# EasyEDA schematic 1-3circuits.json

## Sheets
1 mcu: TITLE: MCU and power filtering; REV: 1.0; Date: 2022-01-01; Sheet: 1/4; Drawn By: Mikita Valatovich; Company: MUNI MASTER DIPLOMA
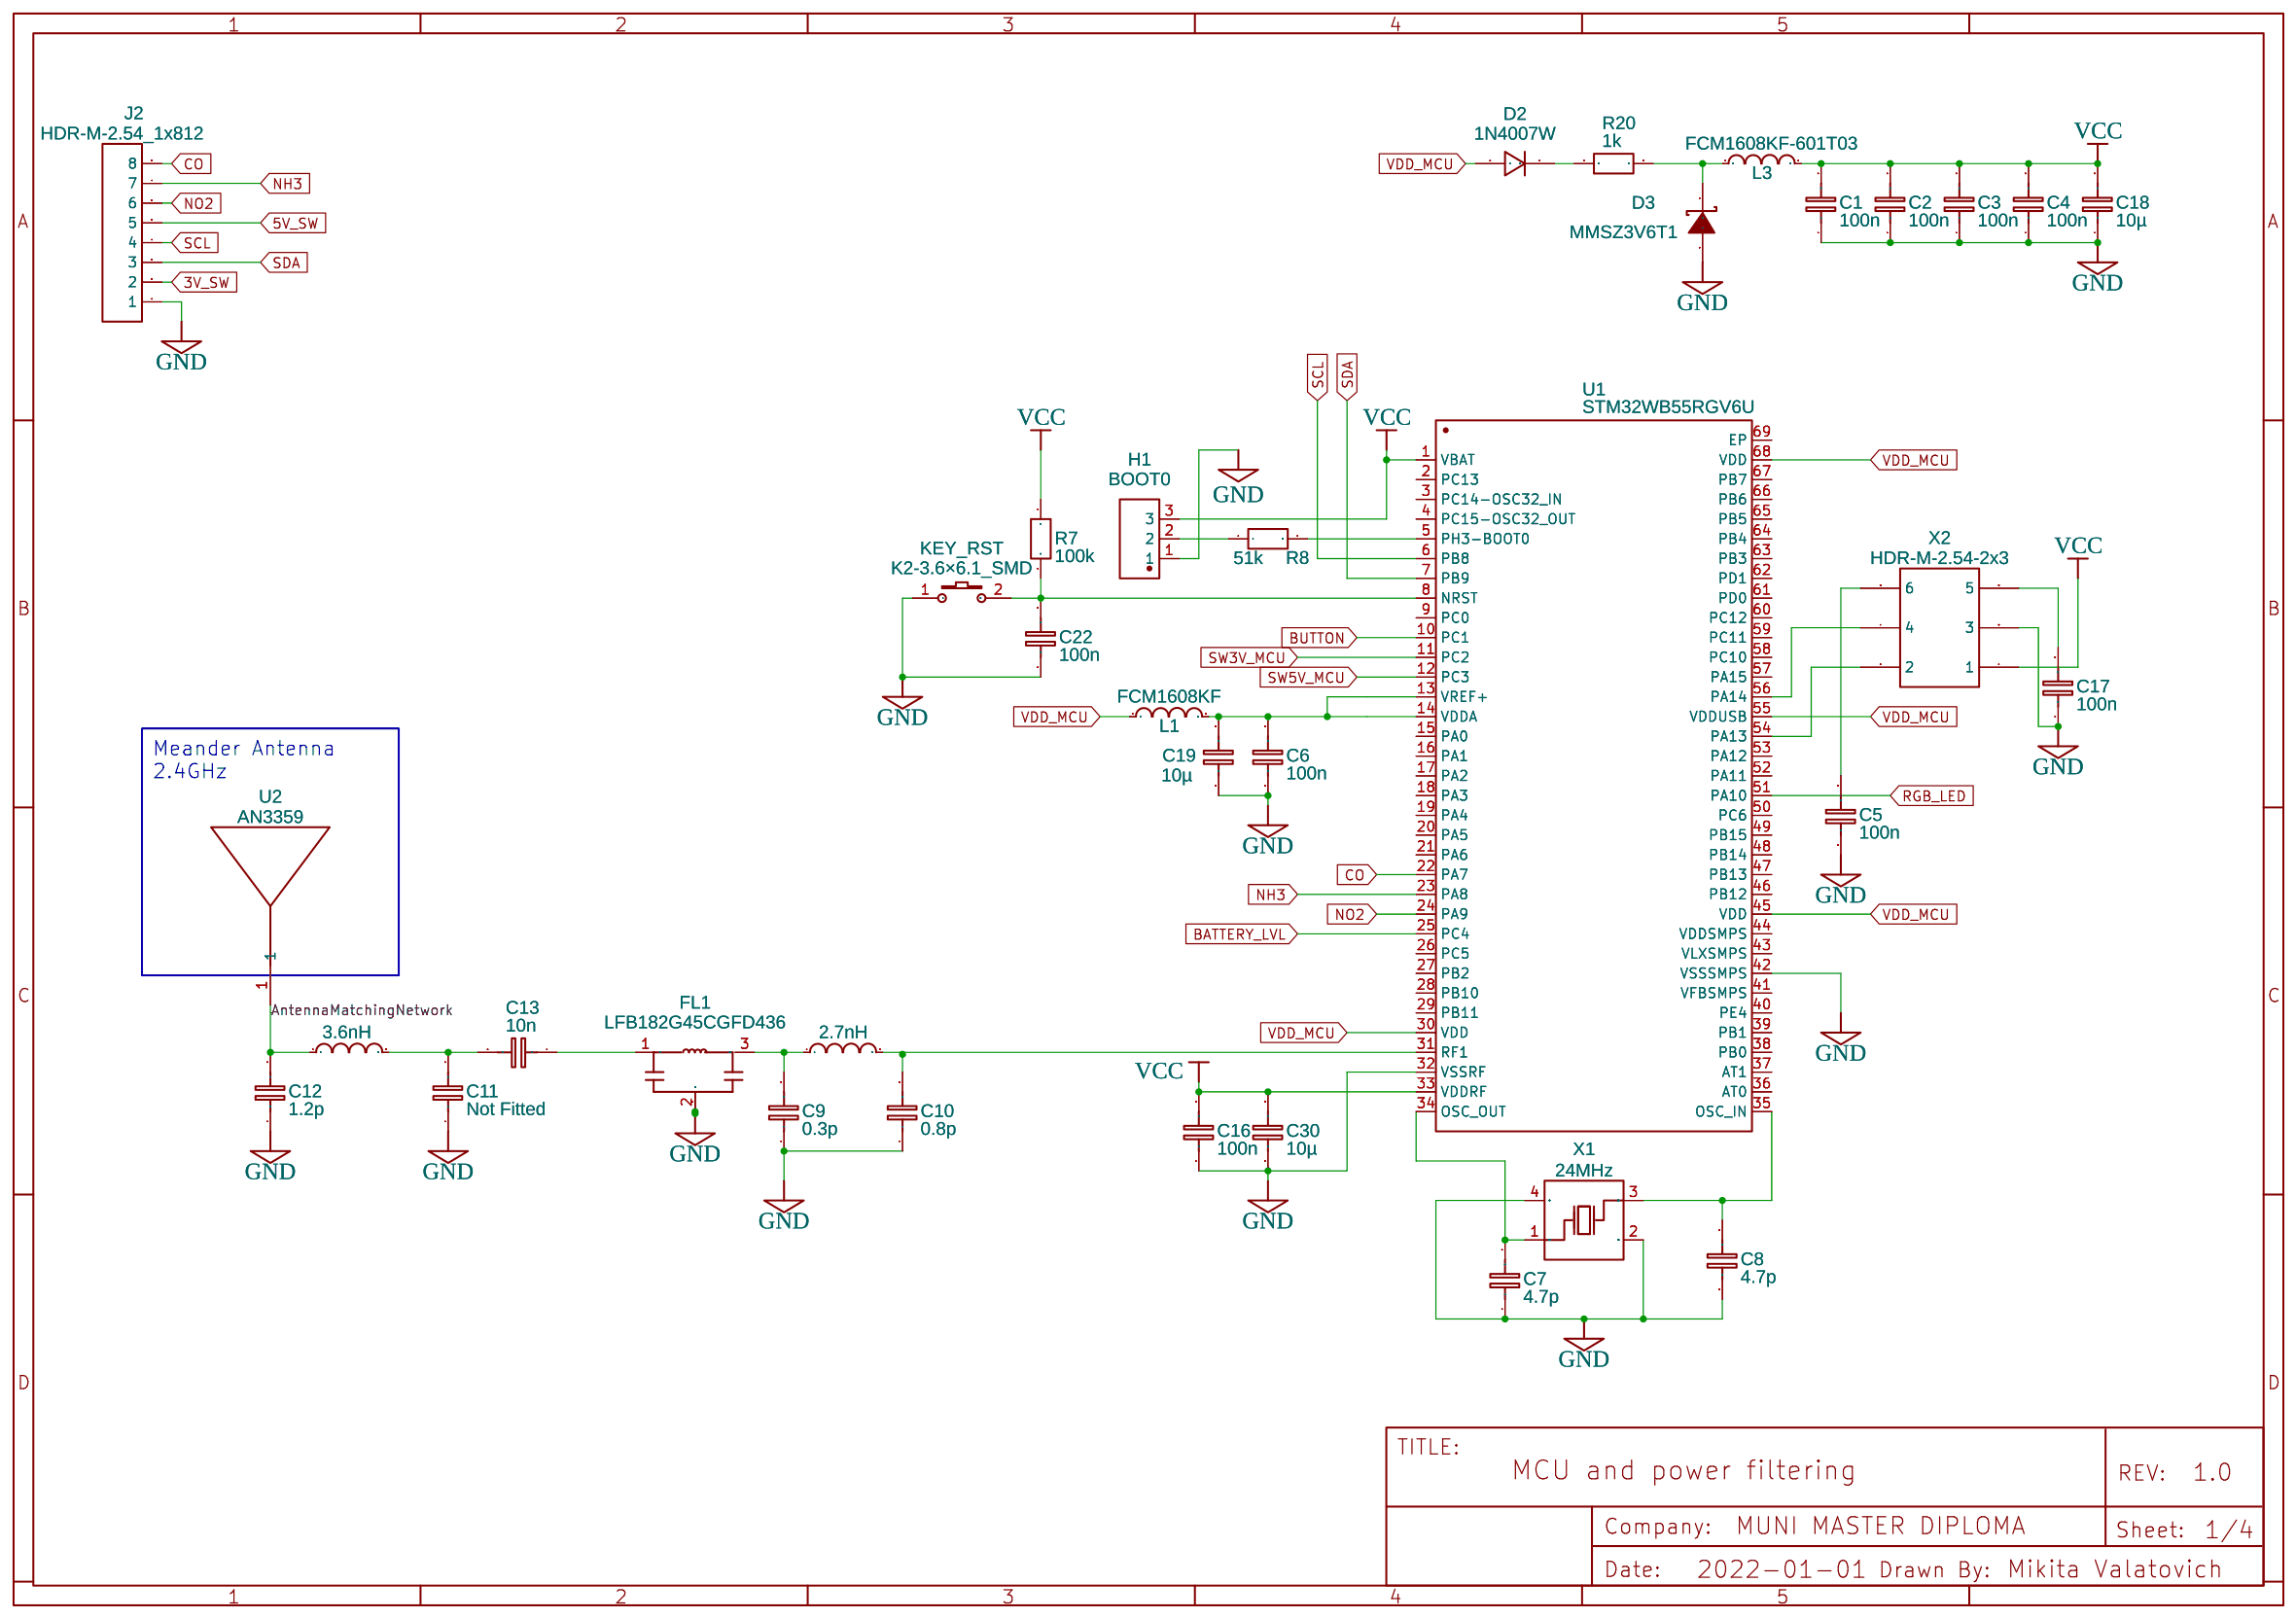
[diagram p0: mcu]
2 peripherals: TITLE: Peripherals; Sheet: 2/4
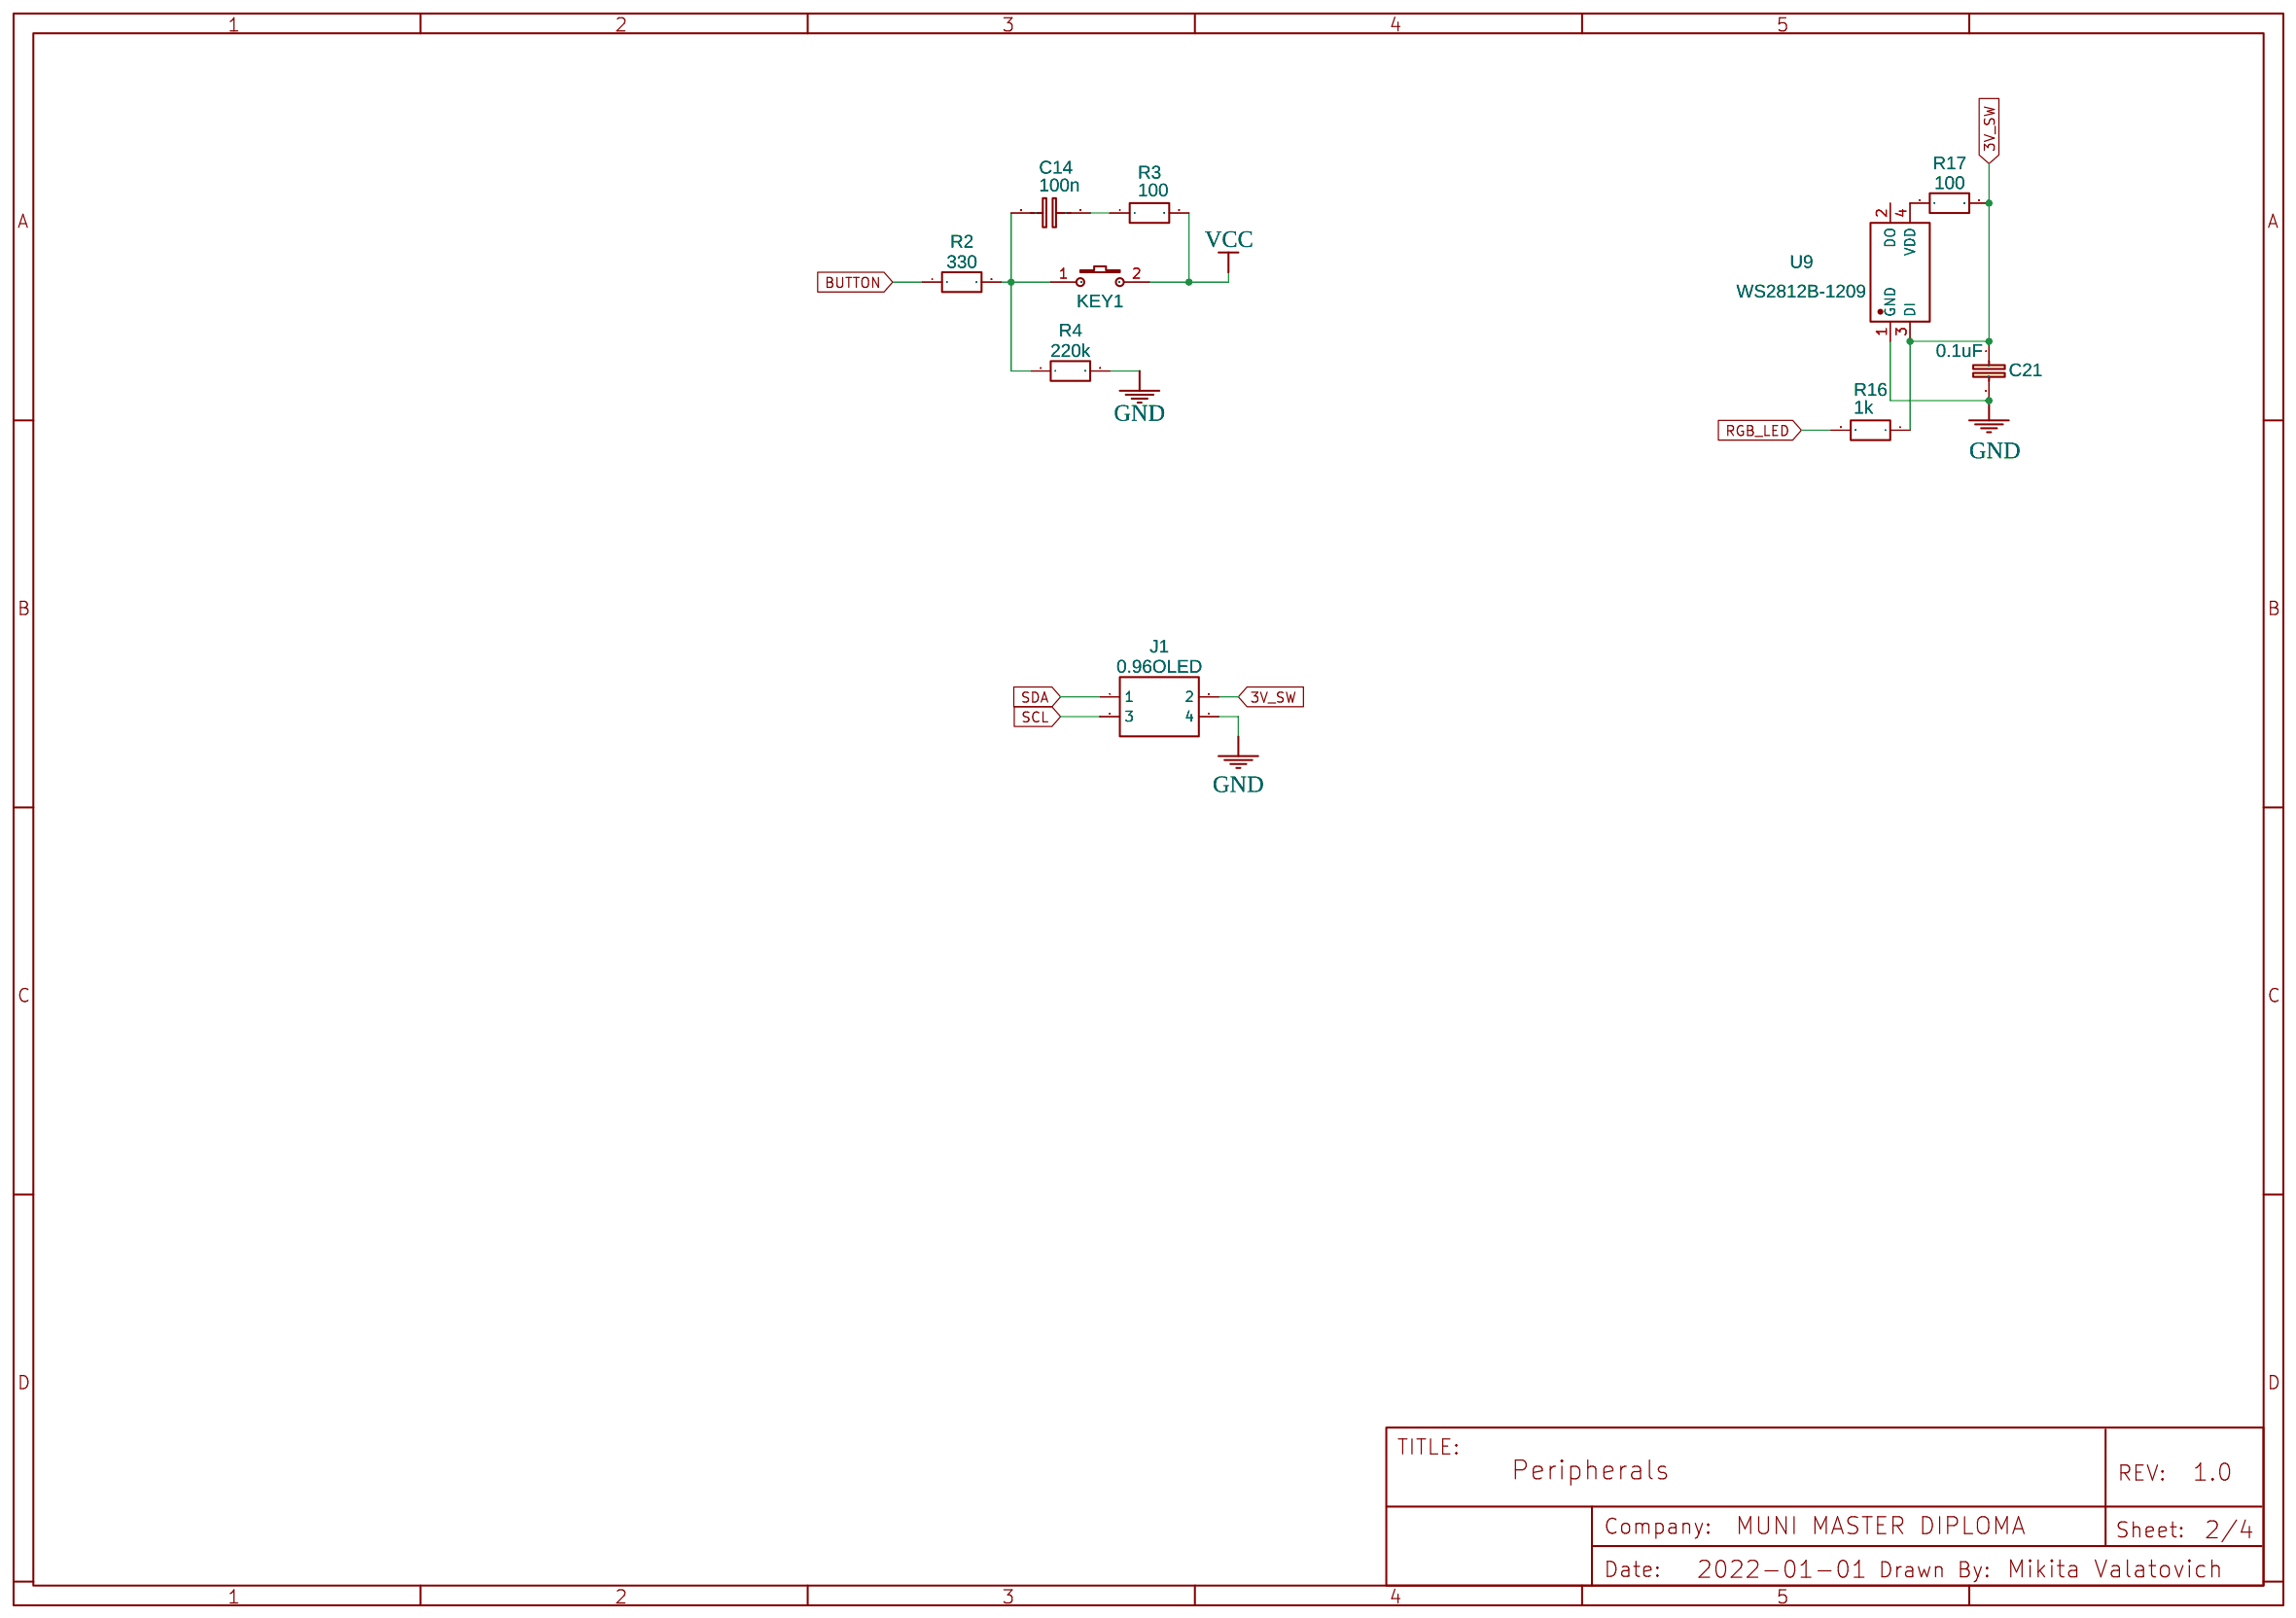
[diagram p1: peripherals]
3 power_supply: TITLE: Power supply; Sheet: 3/4
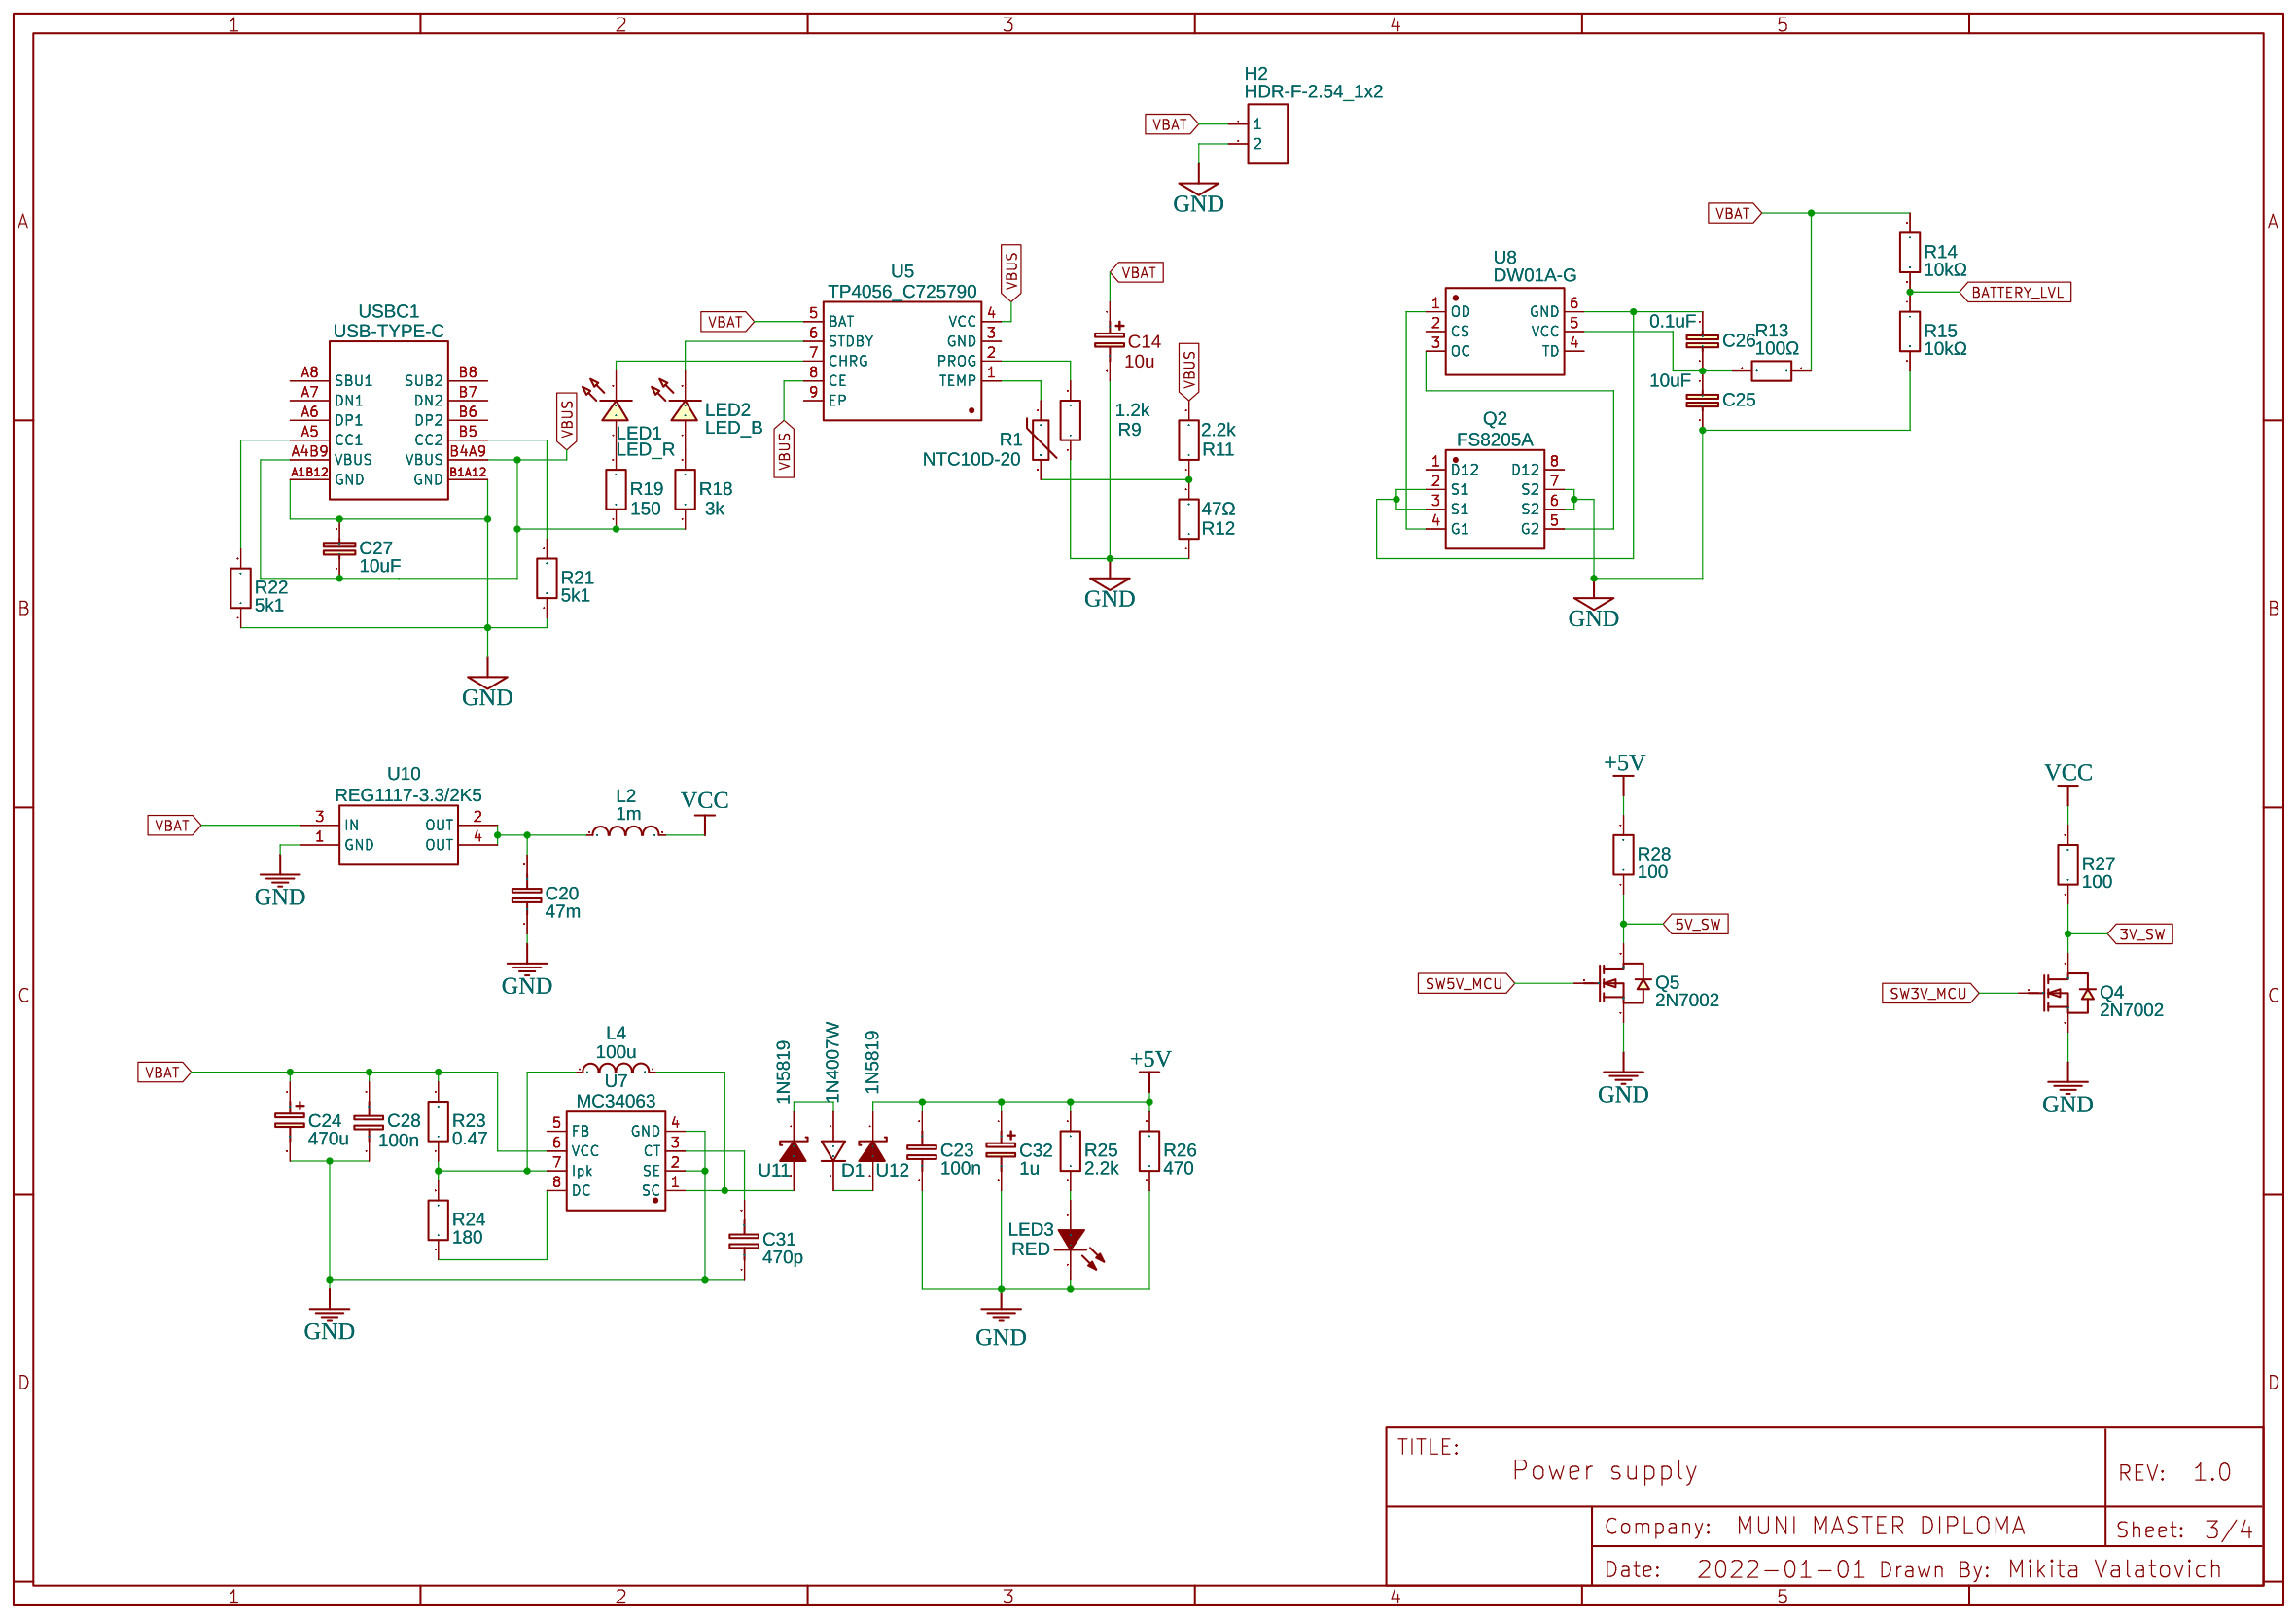
[diagram p2: power_supply]

## Parts
sheet mcu
C1  100n  [C0603]
C2  100n  [C0603]
C3  100n  [C0603]
C4  100n  [C0603]
C5  100n  [C0603]
C6  100n  [C0603]
C7  4.7p  [C0603]
C8  4.7p  [C0603]
C9  0.3p  [C0603]
C10  0.8p  [C0603]
C11  Not Fitted  [C0603]
C12  1.2p  [C0603]
C13  10n  [C0603]
C16  100n  [C0603]
C17  100n  [C0603]
C18  10µ  [C0603]
C19  10µ  [C0603]
C22  100n  [C0603]
C30  10µ  [C0603]
D2  1N4007W  [SOD-123_L2.8-W1.8-LS3.7-RD]
D3  MMSZ3V6T1  [SOD-523_L1.2-W0.8-LS1.6-RD]
FL1  LFB182G45CGFD436  [FIL_LFB182G45CGFD436]
H1  BOOT0  [HDR-TH_03P-P2.54-V-M]
J2  HDR-M-2.54_1x812  [HDR-M-2.54_1X8]
KEY_RST  K2-3.6×6.1_SMD  [KEY-SMD_2P-L6.2-W3.6-LS8.0]
L  3.6nH  [L0402]
L1  FCM1608KF  [L0603]
L3  FCM1608KF-601T03  [L0603]
NO  2.7nH  [L0402]
R7  100k  [R0603]
R8  51k  [R0603]
R20  1k  [R0603]
U1  STM32WB55RGV6U  [VFQFPN-68_L8.0-W8.0-P0.40-TL-EP6.4]
U2  AN3359  [AN3359]
X1  24MHz  [CRYSTAL-SMD_4P-L3.2-W2.5-BL]
X2  HDR-M-2.54-2x3  [HDR-M-2.54-2X3-FP]
sheet peripherals
C14  100n  [C0603]
C21  0.1uF  [0603-CAP]
J1  0.96OLED  [HDR-M-2.54_2X2]
KEY1  K2-3.6×6.1_SMD  [KEY-SMD_2P-L6.2-W3.6-LS8.0]
R2  330  [R0603]
R3  100  [R0603]
R4  220k  [R0603]
R16  1k  [R0603]
R17  100  [R0603]
U9  WS2812B-1209  [LED-SMD_4P-L3.2-W2.7-TL-WS2812B-1209]
sheet power_supply
C20  47m  [C0603]
C23  100n  [C0603]
C24  470u  [CASE-A_3216]
C25  10uF  [0603-CAP]
C26  0.1uF  [0603-CAP]
C27  10uF  [0603-CAP]
C28  100n  [C0603]
C31  470p  [C0603]
C32  1u  [CASE-A_3216]
D1  1N4007W  [SOD-123_L2.8-W1.8-LS3.7-RD]
H2  HDR-F-2.54_1x2  [HDR-F-2.54_1X2]
L2  1m  [L0603]
L4  100u  [L0603]
LED1  LED_R  [LED0603_RED]
LED2  LED_B  [LED0603_BLUE]
LED3  RED  [LED0805-FD]
Q2  FS8205A  [TSSOP-8_L4.4-W3.0-P0.65-LS6.4-BL-2]
Q4  2N7002  [SOT-23_L2.9-W1.3-P0.95-LS2.4-BR]
Q5  2N7002  [SOT-23_L2.9-W1.3-P0.95-LS2.4-BR]
R1  NTC10D-20  [THERMISTOR PCB]
R9  1.2k  [R0603]
R11  2.2k  [R0603]
R12  47Ω  [R0603]
R13  100Ω  [R0603]
R14  10kΩ  [R0603]
R15  10kΩ  [R0603]
R18  3k  [R0603]
R19  150  [R0603]
R21  5k1  [R0603]
R22  5k1  [R0603]
R23  0.47  [R0603]
R24  180  [R0603]
R25  2.2k  [R0603]
R26  470  [R0603]
R27  100  [R0603]
R28  100  [R0603]
U5  TP4056_C725790  [ESOP-8_L4.9-W3.9-P1.27-LS6.0-BL-EP]
U6  electrolitic_cap_th_to_smd  [TH_CAP_TO_SMD]
U7  MC34063  [SOP-8_L5.0-W4.0-P1.27-LS6.2-BL]
U8  DW01A-G  [SOT-23-6_L2.9-W1.6-P0.95-LS2.8-BR]
U10  REG1117-3.3/2K5  [SOT-223_L6.5-W3.5-P2.30-LS7.0-BR]
U11  1N5819  [DO-41_BD2.8-L5.2-P9.20-D0.8-RD]
U12  1N5819  [DO-41_BD2.8-L5.2-P9.20-D0.8-RD]
USBC1  USB-TYPE-C  [USB-TYPE-C_20PIN-FEMALE_TYPE-C-31-M-14]

## Library data of the parts
C1-C14 C16-C20 C22 C23 C28 C30 C31 = C_0603_EU: Contributor: LCEDA_Lib
D1 D2 = 1N4007W: Supplier: LCSC; Supplier Part: C328592; Manufacturer: BLUE ROCKET; Contributor: LCEDA_Lib
D3 = DIODEZENER3.3V500MWSOD-523: Supplier: LCSC; Supplier Part: C9900023612; Manufacturer: null; JLCPCB Part Class: Extended Part; Contributor: lcsc
FL1 = LFB182G45CGFD436: Contributor: Anderson Macedo
H1 = PZ254-1-03-Z-8.5: Supplier: LCSC; Supplier Part: C2894926; Manufacturer: HCTL(华灿天禄); Contributor: LCSC; JLCPCB Part Class: Extended Part
J2 = HDR-M-2.54_1x812: Supplier Part: C190820; Supplier: LCSC; Contributor: Hane_Jared
KEY1 KEY_RST = K2-3.6×6.1_SMD: Supplier Part: C118141; Supplier: LCSC; Manufacturer Part: K2-1107ST-A4SW-06; Contributor: LCEDA_Lib; 制造商: 韩国韩荣
L = LQG15HS3N6S02D: Manufacturer: MuRata; Supplier: Mouser; Supplier Part: 81-LQG15HS3N6S02D; link: https://www.mouser.fr/ProductDetail/Murata-Electronics/LQG15HS3N6S02D?qs=%2Fha2pyFadujBRa%2Fp5CVwGzDiTwg7pAvUcar2Z1OiPA%2FfvOHatjByeQ%3D%3D; Contributor: cyrilledecourtois; Température: -55 +125°C; Prix: 0.085
L1 L3 = FCM1608KF-601T03: Supplier: LCSC; Supplier Part: C141723; Manufacturer: TAITEC; Contributor: LCSC; JLCPCB Part Class: Extended Part
NO = LQG15HS2N7S02D: Manufacturer: MuRata; Supplier: Mouser; Supplier Part: 81-LQG15HS2N7S02D; link: https://www.mouser.fr/ProductDetail/Murata-Electronics/LQG15HS2N7S02D?qs=%2Fha2pyFadujt2OiWqNJoxRoxw7kBv0%252ByrT6n939VFw4zHSInabTFCw%3D%3D; Contributor: cyrilledecourtois; Température: -55 +125°C; Prix: 0.085
R2-R4 R7 R8 R20-R28 = R_0603_EU: Contributor: LCEDA_Lib
U1 = STM32WB55RGV6U: Supplier: LCSC; Supplier Part: C1558433; Manufacturer: ST(意法半导体); Contributor: LCSC
U2 = AN3359: Manufacturer Part: N/A; Supplier Part: N/A; Contributor: ktw07182
X1 = ABM8AIG-24.000MHZ-R40-4-T: Supplier: LCSC; Supplier Part: C1986620; Manufacturer: ABRACON; Contributor: LCSC; JLCPCB Part Class: Extended Part
X2 = HDR-M-2.54-2x3: Contributor: dalex806
C21 C25-C27 = 0.1UF-25V(+80_-20%)(0603): CAP-00810; Contributor: SparkFun
J1 = HDR-M-2.54_2x2: Supplier Part: C66690; Supplier: LCSC; Contributor: LCEDA_Lib
R9 R11-R19 = TCTR0603F47K0F3960T: Supplier: LCSC; Supplier Part: C525388; Manufacturer: Resistor.Today; Contributor: LCSC; JLCPCB Part Class: Extended Part
U9 = WS2812B-1209: Supplier: LCSC; Supplier Part: C2835111; Manufacturer: null; Contributor: LCSC; JLCPCB Part Class: Extended Part
C24 C32 = C_Tan_SMD_A_EU: Contributor: LCEDA_Lib
H2 = HDR-F-2.54_1x2: Supplier Part: C49661; Supplier: LCSC; Contributor: LCEDA_Lib
L2 L4 = L0603_US: Contributor: LCEDA_Lib
LED1 = LED-0603_R: Manufacturer: EVERLIGHT(台湾亿光); Manufacturer Part: 19-217/R6C-AL1M2VY/3T; Supplier Part: C72044; Supplier: LCSC; Contributor: LCEDA_01
LED2 = LED-0603_B: Manufacturer: EVERLIGHT(台湾亿光); Manufacturer Part: 19-217/BHC-ZL1M2RY/3T; Supplier Part: C72041; Supplier: LCSC; Contributor: LCEDA_01
LED3 = whiteLEDSMD: Supplier: LCSC; Manufacturer: KENTO; Supplier Part: C34499; JLCPCB Part Class: Basic Part
Q2 = FS8205A: Supplier: LCSC; Manufacturer: FORTUNE; Supplier Part: C16052; JLCPCB Part Class: Extended Part
Q4 Q5 = 2N7002: Supplier: LCSC; Manufacturer: Nexperia; Manufacturer Part: 2N7002,215; image: //image.lceda.cn/szlcsc/C65189.jpg; Supplier Part: C65189; Paste Type: expand; Contributor: LCEDA_Lib
R1 = Thermistor: Manufacturer: RUILON; Manufacturer Part: NTCThermistor; Supplier Part: C42975; Contributor: wm_irsyaduddin
U5 = TP4056_C725790: Supplier: LCSC; Supplier Part: C725790; Manufacturer: UMW(Youtai Semiconductor Co., Ltd.); Manufacturer Part: TP4056; Contributor: LCSC; JLCPCB Part Class: Extended Part
U6 = electrolitic_cap_th_to_smd: Contributor: c3xp
U7 = MC34063ADR_C3014308: Supplier: LCSC; Supplier Part: C3014308; Manufacturer: UMW(友台半导体); Manufacturer Part: MC34063ADR; link: https://atta.szlcsc.com/upload/public/pdf/source/20220516/88AE1B1DEFDD868D362DEBC351A9CC18.pdf; Contributor: lcsc
U8 = DW01A-G: Supplier: LCSC; Manufacturer: FORTUNE; Contributor: LCSC; Supplier Part: C61503; JLCPCB Part Class: Extended Part
U10 = REG1117-3.3/2K5: Supplier: LCSC; Manufacturer: TI; Contributor: LCSC; Supplier Part: C139396; JLCPCB Part Class: Extended Part
U11 U12 = 1N5819_C3039965: Supplier: LCSC; Supplier Part: C3039965; Manufacturer: YFW(佑风微); link: https://atta.szlcsc.comnull; Contributor: lcsc
USBC1 = USB-TYPE-C: Supplier Part: C223907; Manufacturer: Rectangular Connectors - Contacts; Manufacturer Part: TYPE-C-31-M-14; Contributor: Dragomir Liviu Marian

## Nets
3V_SW: C21.1 J1.2 J2.2 Q4.3(D) R16.1 R17.2 R27.1 U9.3(DI)
5V_SW: J2.5 Q5.3(D) R28.1
+5V: C23.2 C32.1 R25.2 R26.2 R28.2 U12.1(K)
GND: C1.1 C2.1 C3.1 C4.1 C5.1 C6.1 C7.1 C8.1 C9.1 C10.1 C11.1 C12.1 C16.1 C17.1 C18.1 C19.1 C20.1 C21.2 C22.1 C23.1 C24.2 C25.2 C27.2 C28.1 C30.1 C31.1 C32.2 D3.2(A) FL1.2(GND) FL1.2_1(GND) H1.1 H2.2 J1.4 J2.1 KEY_RST.1 LED3.2(K) Q2.6(S2) Q2.7(S2) Q4.2(S) Q5.2(S) R4.2 R9.1 R12.1 R15.2 R21.1 R22.1 R26.1 U1.32(VSSRF) U1.42(VSSSMPS) U6.2 U7.2(SE) U7.4(GND) U9.1(GND) U10.1(GND) USBC1.A1B12(GND) USBC1.B1A12(GND) X1.2(GND) X1.4(GND) X2.3
VBAT: C24.1 C28.2 H2.1 R13.1 R14.1 R23.2 U5.5(BAT) U6.1 U7.6(VCC) U10.3(IN)
VBUS: C27.1 R11.2 R18.1 R19.1 U5.4(VCC) U5.8(CE) USBC1.A4B9(VBUS) USBC1.B4A9(VBUS)
VCC: C1.2 C2.2 C3.2 C4.2 C16.2 C18.2 C30.2 H1.3 KEY1.2 L2.2 L3.2 R3.2 R7.1 R27.2 U1.1(VBAT) U1.33(VDDRF) X2.1
VDD_MCU: D2.2 L1.1 U1.30(VDD) U1.45(VDD) U1.55(VDDUSB) U1.68(VDD)
AntennaMatchingNetwork: C12.2 L.1 U2.1
BATTERY_LVL: R14.2 R15.1 U1.25(PC4)
BUTTON: R2.1 U1.10(PC1)
CO: J2.8 U1.22(PA7)
NH3: J2.7 U1.23(PA8)
NO2: J2.6 U1.24(PA9)
RGB_LED: R16.2 U1.51(PA10)
SCL: J1.3 J2.4 U1.6(PB8)
SDA: J1.1 J2.3 U1.7(PB9)
SW3V_MCU: Q4.1(G) U1.11(PC2)
SW5V_MCU: Q5.1(G) U1.12(PC3)
Net-(C5-2): C5.2 X2.6
Net-(C6-2): C6.2 C19.2 L1.2 U1.13(VREF+) U1.14(VDDA)
Net-(C7-2): C7.2 U1.34(OSC_OUT) X1.1(OSC1)
Net-(C8-2): C8.2 U1.35(OSC_IN) X1.3(OSC2)
Net-(C9-2): C9.2 FL1.3(OUT) NO.1
Net-(C10-2): C10.2 NO.2 U1.31(RF1)
Net-(C11-2): C11.2 C13.2 L.2
Net-(C13-1): C13.1 FL1.1(IN)
Net-(C14-1): C14.1 KEY1.1 R2.2 R4.1
Net-(C14-2): C14.2 R3.1
Net-(C17-2): C17.2 X2.5
Net-(C20-2): C20.2 L2.1 U10.2(OUT) U10.4(OUT)
Net-(C22-2): C22.2 KEY_RST.2 R7.2 U1.8(NRST)
Net-(C25-1): C25.1 C26.2 R13.2 U8.5(VCC)
Net-(C26-1): C26.1 Q2.2(S1) Q2.3(S1) U8.6(GND)
Net-(C31-2): C31.2 U7.3(CT)
Net-(D1-1): D1.1 U12.2(A)
Net-(D1-2): D1.2 U11.1(K)
Net-(D2-1): D2.1 R20.1
Net-(D3-1): D3.1(K) L3.1 R20.2
Net-(H1-2): H1.2 R8.1
Net-(L4-1): L4.1 R23.1 R24.2 U7.7(Ipk)
Net-(L4-2): L4.2 U7.1(SC) U11.2(A)
Net-(LED1-1): LED1.1 R19.2
Net-(LED1-2): LED1.2 U5.7(CHRG)
Net-(LED2-1): LED2.1 R18.2
Net-(LED2-2): LED2.2 U5.6(STDBY)
Net-(LED3-1): LED3.1(A) R25.1
Net-(Q2-4): Q2.4(G1) U8.1(OD)
Net-(Q2-5): Q2.5(G2) U8.3(OC)
Net-(R1-1): R1.1 U5.1(TEMP)
Net-(R1-2): R1.2 R11.1 R12.2
Net-(R8-2): R8.2 U1.5(PH3-BOOT0)
Net-(R9-2): R9.2 U5.2(PROG)
Net-(R17-1): R17.1 U9.4(VDD)
Net-(R21-2): R21.2 USBC1.B5(CC2)
Net-(R22-2): R22.2 USBC1.A5(CC1)
Net-(R24-1): R24.1 U7.8(DC)
Net-(U1-54): U1.54(PA13) X2.2
Net-(U1-56): U1.56(PA14) X2.4

Not connected (* = marked no-connect by the designer): Q2 1(D12) 8(D12); U1 2(PC13) 3(PC14-OSC32_IN) 4(PC15-OSC32_OUT) 9(PC0) 15(PA0) 16(PA1) 17(PA2) 18(PA3) 19(PA4) 20(PA5) 21(PA6) 26(PC5) 27(PB2) 28(PB10) 29(PB11) 36(AT0) 37(AT1) 38(PB0) 39(PB1) 40(PE4) 41(VFBSMPS) 43(VLXSMPS) 44(VDDSMPS) 46(PB12) 47(PB13) 48(PB14) 49(PB15) 50(PC6) 52(PA11) 53(PA12) 57(PA15) 58(PC10) 59(PC11) 60(PC12) 61(PD0) 62(PD1) 63(PB3) 64(PB4) 65(PB5) 66(PB6) 67(PB7) 69(EP); U5 3(GND) 9(EP); U7 5(FB); U8 2(CS) 4(TD); U9 2(DO); USBC1 A6(DP1) A7(DN1) A8(SBU1) B6(DP2) B7(DN2) B8(SUB2)

## Notes on the sheets
sheet 1
- Meander Antenna
  2.4GHz
